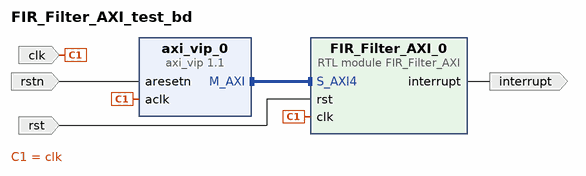
[diagram p0: block diagram of the top level]
# Vivado block design FIR_Filter_AXI_test_bd, xc7z010clg400-1, Vivado 2020.1
create_bd_design FIR_Filter_AXI_test_bd

create_bd_port -dir I -type clk clk
set_property -dict {CONFIG.FREQ_HZ 100000000} [get_bd_ports clk]
create_bd_port -dir I -type rst rstn
create_bd_port -dir I -type rst rst
create_bd_port -dir O -type intr interrupt

create_bd_cell -type ip -vlnv xilinx.com:ip:axi_vip:1.1 axi_vip_0
set_property -dict [list \
  CONFIG.ADDR_WIDTH 32 \
  CONFIG.DATA_WIDTH 32 \
  CONFIG.HAS_BRESP 1 \
  CONFIG.HAS_PROT 1 \
  CONFIG.HAS_RRESP 1 \
  CONFIG.HAS_WSTRB 1 \
  CONFIG.INTERFACE_MODE MASTER \
  CONFIG.PROTOCOL AXI4LITE \
  CONFIG.READ_WRITE_MODE READ_WRITE \
] [get_bd_cells axi_vip_0]
create_bd_cell -type module -reference FIR_Filter_AXI FIR_Filter_AXI_0

# ---- connections ----

connect_bd_intf_net [get_bd_intf_pins axi_vip_0/M_AXI] [get_bd_intf_pins FIR_Filter_AXI_0/S_AXI4]
connect_bd_net [get_bd_ports clk] [get_bd_pins axi_vip_0/aclk] [get_bd_pins FIR_Filter_AXI_0/clk]
connect_bd_net [get_bd_ports rstn] [get_bd_pins axi_vip_0/aresetn]
connect_bd_net [get_bd_ports rst] [get_bd_pins FIR_Filter_AXI_0/rst]
connect_bd_net [get_bd_pins FIR_Filter_AXI_0/interrupt] [get_bd_ports interrupt]

validate_bd_design
save_bd_design
